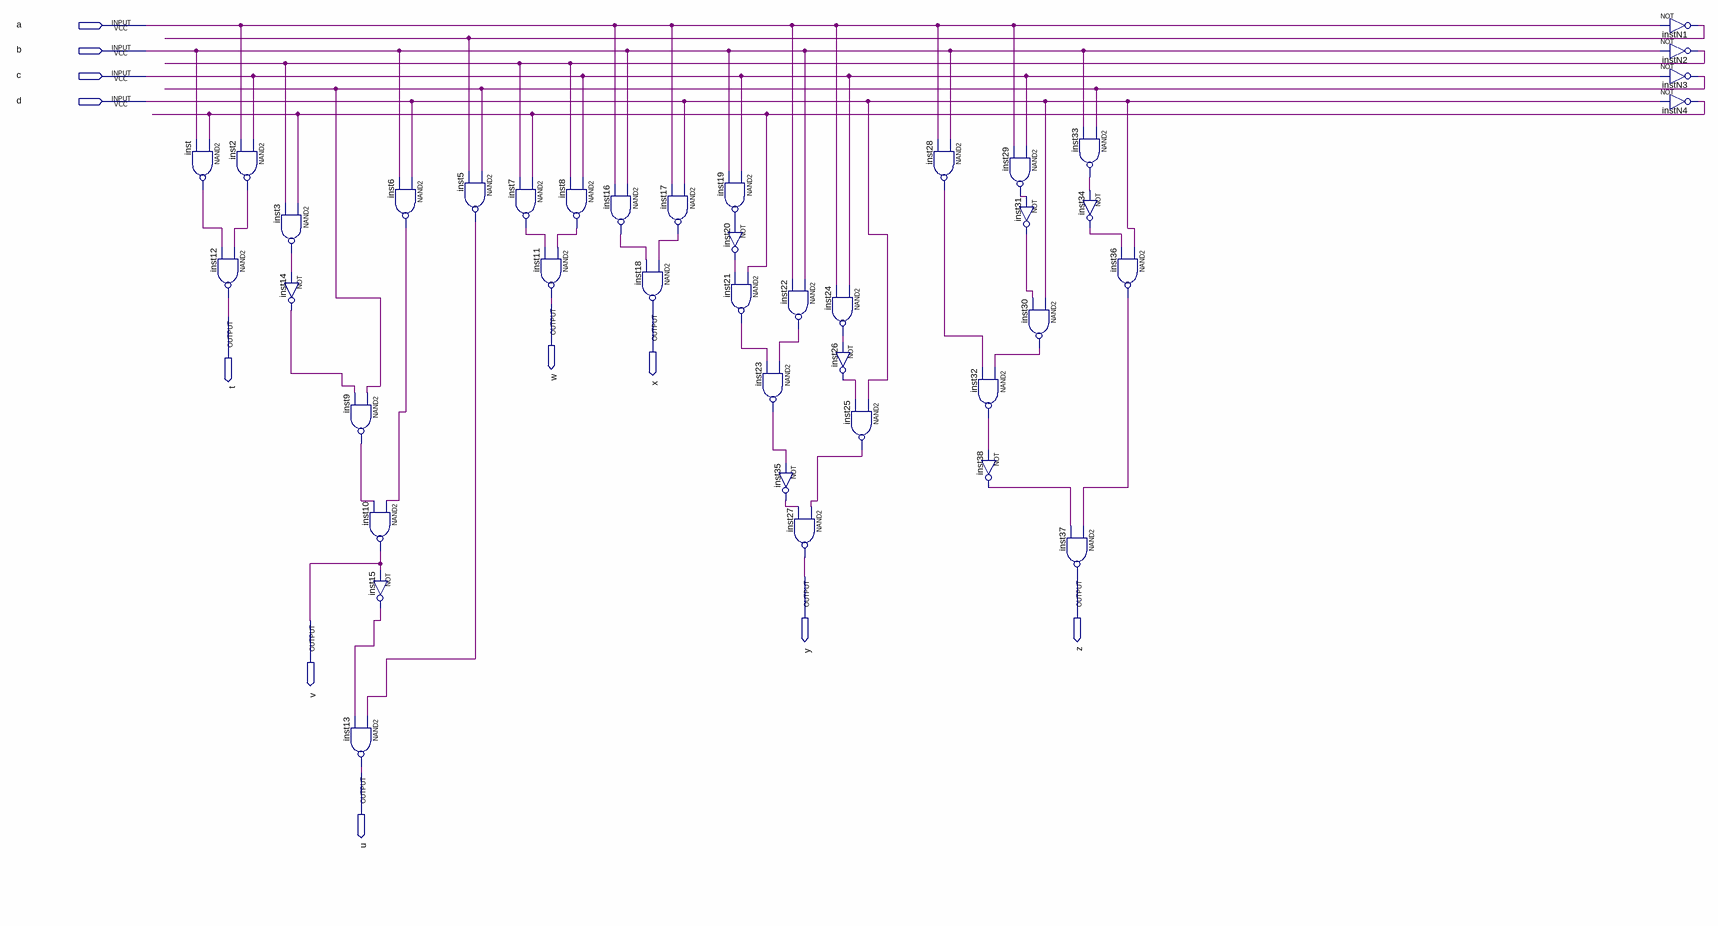
[diagram p0: schematic sheet]
// Quartus schematic BCD_gate_level_reference.bdf as structural Verilog: 41 symbols, 11 pins
module BCD_gate_level_reference (
  input  a,
  input  b,
  input  c,
  input  d,
  output w,
  output x,
  output t,
  output y,
  output z,
  output v,
  output u
);

  wire inst2_out, inst3_out, inst5_out, inst6_out, inst7_out, inst8_out, inst9_out, inst14_out, inst15_out,
       inst16_out, inst17_out, inst19_out, inst20_out, inst21_out, inst22_out, inst23_out, inst24_out,
       inst25_out, inst26_out, inst28_out, inst29_out, inst30_out, inst31_out, inst32_out, inst33_out,
       inst34_out, inst35_out, inst36_out, inst38_out, inst_out, instN1_out, instN2_out, instN3_out,
       instN4_out;

  nand inst (inst_out, instN4_out, b);
  nand inst2 (inst2_out, c, a);
  nand inst12 (t, inst2_out, inst_out);
  nand inst3 (inst3_out, instN4_out, instN2_out);
  not inst14 (inst14_out, inst3_out);
  nand inst9 (inst9_out, instN3_out, inst14_out);
  nand inst13 (u, inst5_out, inst15_out);
  nand inst6 (inst6_out, d, b);
  nand inst10 (v, inst6_out, inst9_out);
  not inst15 (inst15_out, v);
  nand inst5 (inst5_out, instN3_out, instN1_out);
  nand inst7 (inst7_out, instN4_out, instN2_out);
  nand inst11 (w, inst8_out, inst7_out);
  nand inst8 (inst8_out, c, instN2_out);
  nand inst16 (inst16_out, b, a);
  nand inst18 (x, inst17_out, inst16_out);
  nand inst17 (inst17_out, d, a);
  nand inst19 (inst19_out, c, b);
  not inst20 (inst20_out, inst19_out);
  nand inst21 (inst21_out, instN4_out, inst20_out);
  nand inst22 (inst22_out, b, a);
  nand inst23 (inst23_out, inst22_out, inst21_out);
  not inst35 (inst35_out, inst23_out);
  nand inst27 (y, inst25_out, inst35_out);
  nand inst24 (inst24_out, c, a);
  not inst26 (inst26_out, inst24_out);
  nand inst25 (inst25_out, d, inst26_out);
  nand inst28 (inst28_out, b, a);
  nand inst29 (inst29_out, c, a);
  nand inst32 (inst32_out, inst30_out, inst28_out);
  not inst38 (inst38_out, inst32_out);
  not inst31 (inst31_out, inst29_out);
  nand inst30 (inst30_out, d, inst31_out);
  nand inst33 (inst33_out, instN3_out, b);
  not inst34 (inst34_out, inst33_out);
  nand inst37 (z, inst36_out, inst38_out);
  nand inst36 (inst36_out, d, inst34_out);
  not instN1 (instN1_out, a);
  not instN2 (instN2_out, b);
  not instN3 (instN3_out, c);
  not instN4 (instN4_out, d);
endmodule
